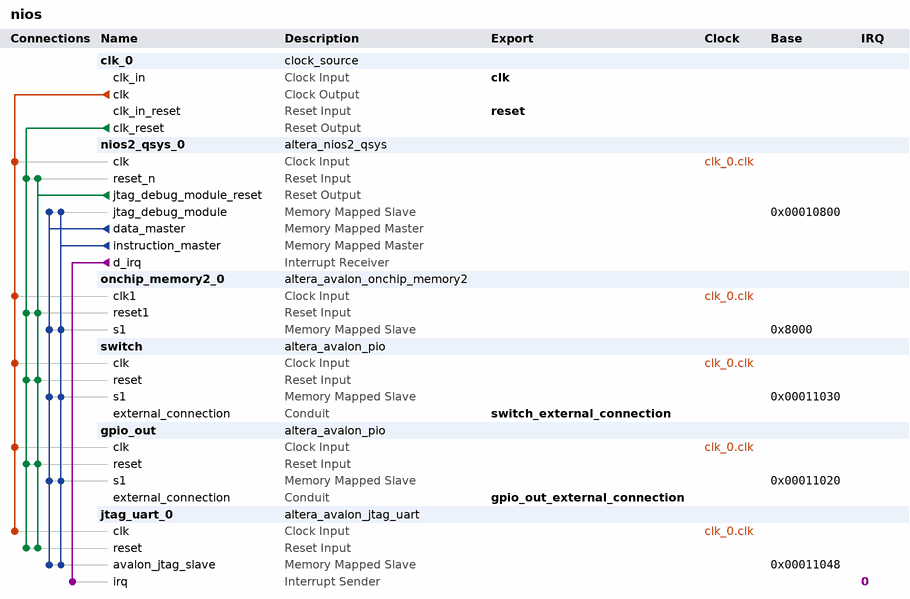
[diagram p0: system contents]
# Platform Designer (Qsys) system nios, Cyclone IV E EP4CE115F29C7
# Parameters at their usual value, and those the tool derives, are not listed.
package require -exact qsys 18.1
create_system nios
set_project_property DEVICE_FAMILY {Cyclone IV E}
set_project_property DEVICE EP4CE115F29C7

add_instance clk_0 clock_source 18.1
set_instance_parameter_value clk_0 clockFrequency 50000000

add_instance nios2_qsys_0 altera_nios2_qsys 16.1
set_instance_parameter_value nios2_qsys_0 breakSlave nios2_qsys_0.jtag_debug_module
set_instance_parameter_value nios2_qsys_0 exceptionSlave onchip_memory2_0.s1
set_instance_parameter_value nios2_qsys_0 icache_size 4096
set_instance_parameter_value nios2_qsys_0 impl Tiny
set_instance_parameter_value nios2_qsys_0 mmu_TLBMissExcSlave None
set_instance_parameter_value nios2_qsys_0 resetSlave onchip_memory2_0.s1
set_instance_parameter_value nios2_qsys_0 resetrequest_enabled true

add_instance onchip_memory2_0 altera_avalon_onchip_memory2 18.1
set_instance_parameter_value onchip_memory2_0 dataWidth 32
set_instance_parameter_value onchip_memory2_0 dualPort false
set_instance_parameter_value onchip_memory2_0 initMemContent true
set_instance_parameter_value onchip_memory2_0 initializationFileName onchip_mem.hex
set_instance_parameter_value onchip_memory2_0 memorySize 20480

add_instance switch altera_avalon_pio 18.1
set_instance_parameter_value switch direction Input
set_instance_parameter_value switch width 1

add_instance gpio_out altera_avalon_pio 18.1
set_instance_parameter_value gpio_out direction Output
set_instance_parameter_value gpio_out width 1

add_instance jtag_uart_0 altera_avalon_jtag_uart 18.1
set_instance_parameter_value jtag_uart_0 simInteractiveOptions NO_INTERACTIVE_WINDOWS

# connections
add_connection clk_0.clk gpio_out.clk clock
add_connection clk_0.clk jtag_uart_0.clk clock
add_connection clk_0.clk nios2_qsys_0.clk clock
add_connection clk_0.clk onchip_memory2_0.clk1 clock
add_connection clk_0.clk switch.clk clock
add_connection clk_0.clk_reset gpio_out.reset reset
add_connection clk_0.clk_reset jtag_uart_0.reset reset
add_connection clk_0.clk_reset nios2_qsys_0.reset_n reset
add_connection clk_0.clk_reset onchip_memory2_0.reset1 reset
add_connection clk_0.clk_reset switch.reset reset
add_connection nios2_qsys_0.jtag_debug_module_reset gpio_out.reset reset
add_connection nios2_qsys_0.jtag_debug_module_reset jtag_uart_0.reset reset
add_connection nios2_qsys_0.jtag_debug_module_reset nios2_qsys_0.reset_n reset
add_connection nios2_qsys_0.jtag_debug_module_reset onchip_memory2_0.reset1 reset
add_connection nios2_qsys_0.jtag_debug_module_reset switch.reset reset
add_connection nios2_qsys_0.data_master gpio_out.s1 avalon
set_connection_parameter_value nios2_qsys_0.data_master/gpio_out.s1 baseAddress 0x00011020
add_connection nios2_qsys_0.data_master jtag_uart_0.avalon_jtag_slave avalon
set_connection_parameter_value nios2_qsys_0.data_master/jtag_uart_0.avalon_jtag_slave baseAddress 0x00011048
add_connection nios2_qsys_0.data_master nios2_qsys_0.jtag_debug_module avalon
set_connection_parameter_value nios2_qsys_0.data_master/nios2_qsys_0.jtag_debug_module baseAddress 0x00010800
add_connection nios2_qsys_0.data_master onchip_memory2_0.s1 avalon
set_connection_parameter_value nios2_qsys_0.data_master/onchip_memory2_0.s1 baseAddress 0x8000
add_connection nios2_qsys_0.data_master switch.s1 avalon
set_connection_parameter_value nios2_qsys_0.data_master/switch.s1 baseAddress 0x00011030
add_connection nios2_qsys_0.instruction_master gpio_out.s1 avalon
set_connection_parameter_value nios2_qsys_0.instruction_master/gpio_out.s1 baseAddress 0x00011020
add_connection nios2_qsys_0.instruction_master jtag_uart_0.avalon_jtag_slave avalon
set_connection_parameter_value nios2_qsys_0.instruction_master/jtag_uart_0.avalon_jtag_slave baseAddress 0x00011048
add_connection nios2_qsys_0.instruction_master nios2_qsys_0.jtag_debug_module avalon
set_connection_parameter_value nios2_qsys_0.instruction_master/nios2_qsys_0.jtag_debug_module baseAddress 0x00010800
add_connection nios2_qsys_0.instruction_master onchip_memory2_0.s1 avalon
set_connection_parameter_value nios2_qsys_0.instruction_master/onchip_memory2_0.s1 baseAddress 0x8000
add_connection nios2_qsys_0.instruction_master switch.s1 avalon
set_connection_parameter_value nios2_qsys_0.instruction_master/switch.s1 baseAddress 0x00011030
add_connection nios2_qsys_0.d_irq jtag_uart_0.irq interrupt
set_connection_parameter_value nios2_qsys_0.d_irq/jtag_uart_0.irq irqNumber 0

# exported interfaces
add_interface clk clock sink
set_interface_property clk EXPORT_OF clk_0.clk_in
add_interface gpio_out_external_connection conduit end
set_interface_property gpio_out_external_connection EXPORT_OF gpio_out.external_connection
add_interface reset reset sink
set_interface_property reset EXPORT_OF clk_0.clk_in_reset
add_interface switch_external_connection conduit end
set_interface_property switch_external_connection EXPORT_OF switch.external_connection

set_interconnect_requirement {$system} qsys_mm.clockCrossingAdapter HANDSHAKE
set_interconnect_requirement {$system} qsys_mm.enableEccProtection FALSE
set_interconnect_requirement {$system} qsys_mm.insertDefaultSlave FALSE
set_interconnect_requirement {$system} qsys_mm.maxAdditionalLatency 1

save_system nios.qsys
